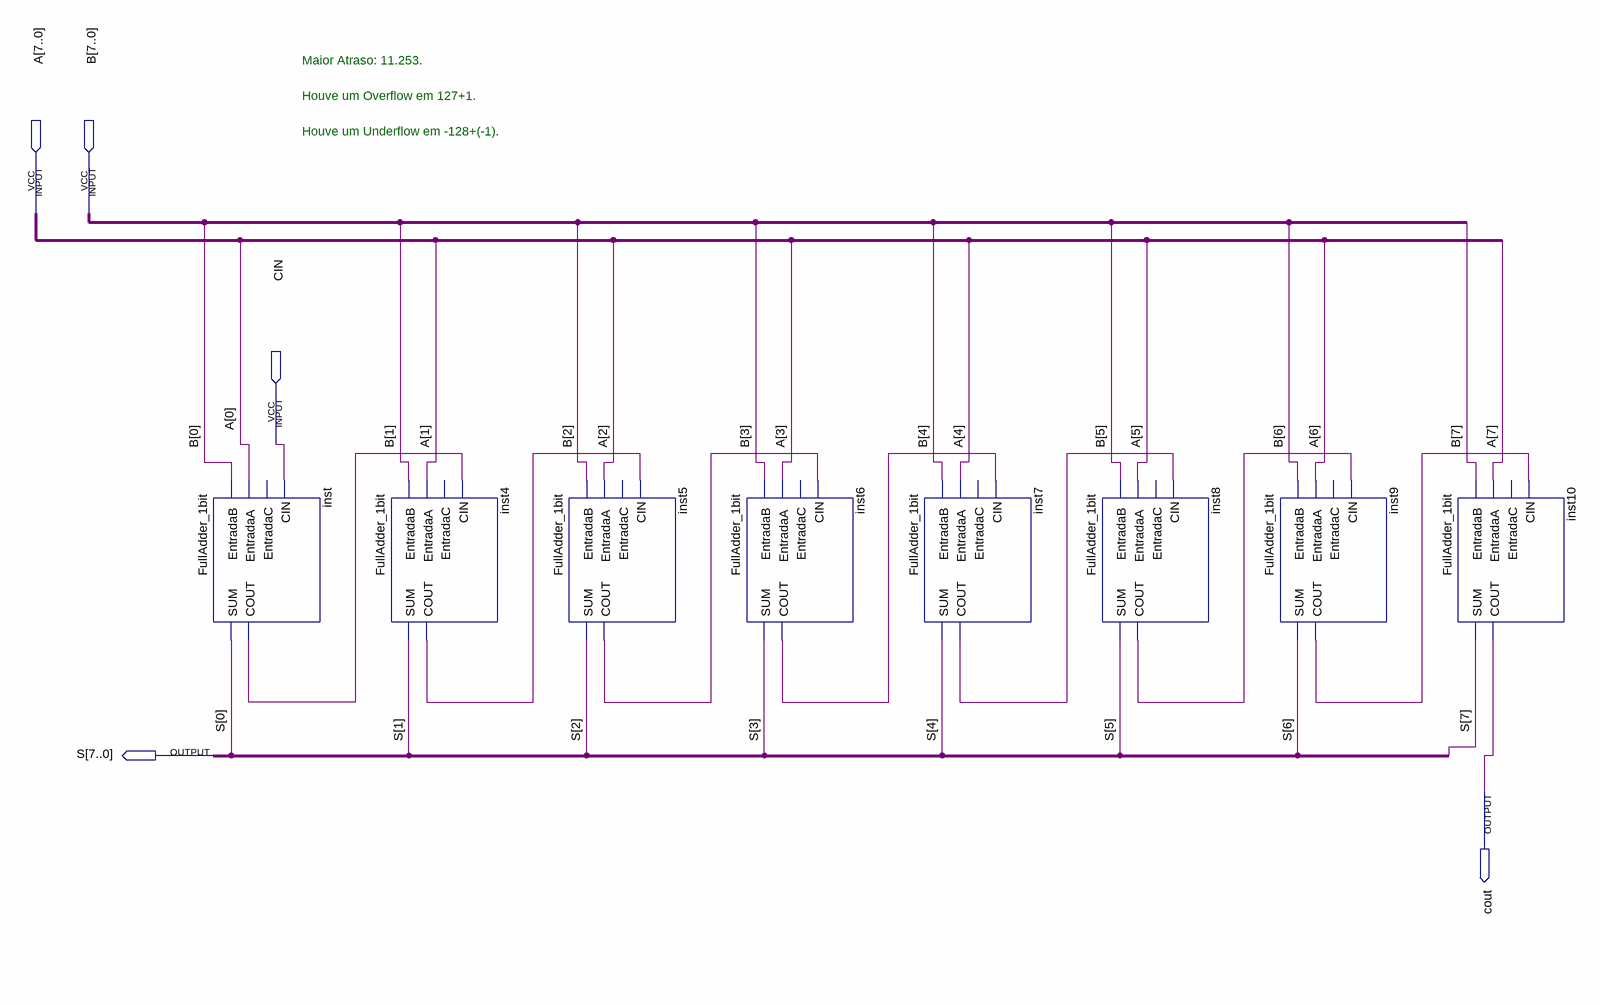
[diagram p0: schematic sheet]
// Quartus schematic FullAdder_8bit.bdf as structural Verilog: 8 symbols, 5 pins
module FullAdder_8bit (
  input  [7:0] A,
  input  [7:0] B,
  input  CIN,
  output [7:0] S,
  output cout
);

  wire inst4_cout, inst5_cout, inst6_cout, inst7_cout, inst8_cout, inst9_cout, inst_cout;

  FullAdder_1bit inst (.EntradaB(B[0]), .EntradaA(A[0]), .CIN(CIN), .SUM(S[0]), .COUT(inst_cout));  // open: EntradaC
  FullAdder_1bit inst4 (
    .EntradaB(B[1]), .EntradaA(A[1]), .CIN(inst_cout), .SUM(S[1]), .COUT(inst4_cout));  // open: EntradaC
  FullAdder_1bit inst5 (
    .EntradaB(B[2]), .EntradaA(A[2]), .CIN(inst4_cout), .SUM(S[2]), .COUT(inst5_cout));  // open: EntradaC
  FullAdder_1bit inst6 (
    .EntradaB(B[3]), .EntradaA(A[3]), .CIN(inst5_cout), .SUM(S[3]), .COUT(inst6_cout));  // open: EntradaC
  FullAdder_1bit inst7 (
    .EntradaB(B[4]), .EntradaA(A[4]), .CIN(inst6_cout), .SUM(S[4]), .COUT(inst7_cout));  // open: EntradaC
  FullAdder_1bit inst8 (
    .EntradaB(B[5]), .EntradaA(A[5]), .CIN(inst7_cout), .SUM(S[5]), .COUT(inst8_cout));  // open: EntradaC
  FullAdder_1bit inst9 (
    .EntradaB(B[6]), .EntradaA(A[6]), .CIN(inst8_cout), .SUM(S[6]), .COUT(inst9_cout));  // open: EntradaC
  FullAdder_1bit inst10 (
    .EntradaB(B[7]), .EntradaA(A[7]), .CIN(inst9_cout), .SUM(S[7]), .COUT(cout));  // open: EntradaC

  // Notes on the sheet:
  //   Maior Atraso: 11.253.
  //   Houve um Overflow em 127+1.
  //   Houve um Underflow em -128+(-1).
endmodule
